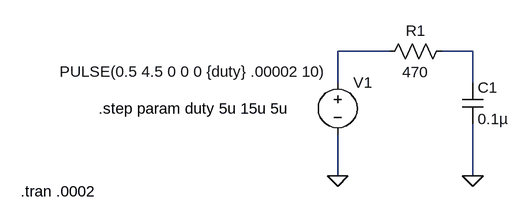
[diagram p0: schematic Input Filter.asc]
Input Filter.asc, the LTspice schematic file:
Version 4
SHEET 1 880 680
WIRE 80 112 0 112
WIRE 208 112 160 112
WIRE 0 160 0 112
WIRE 208 160 208 112
WIRE 0 304 0 240
WIRE 208 304 208 224
FLAG 208 304 0
FLAG 0 304 0
SYMBOL voltage 0 144 R0
WINDOW 3 -15 -1 Right 2
WINDOW 123 0 0 Left 2
WINDOW 39 0 0 Left 2
SYMATTR InstName V1
SYMATTR Value PULSE(0.5 4.5 0 0 0 {duty} .00002 10)
SYMBOL res 64 128 R270
WINDOW 0 32 56 VTop 2
WINDOW 3 0 56 VBottom 2
SYMATTR InstName R1
SYMATTR Value 470
SYMBOL cap 192 160 R0
SYMATTR InstName C1
SYMATTR Value 0.1µ
TEXT -368 200 Left 2 !.step param duty 5u 15u 5u
TEXT -488 328 Left 2 !.tran .0002

The netlist it stands for:
* Input Filter.asc
V1 N001 0 PULSE(0.5 4.5 0 0 0 {duty} .00002 10)
R1 N001 N002 470
C1 N002 0 0.1µ
.step param duty 5u 15u 5u
.tran .0002
.backanno
.end